# EAGLE design untitled (EAGLE 9.3.2)
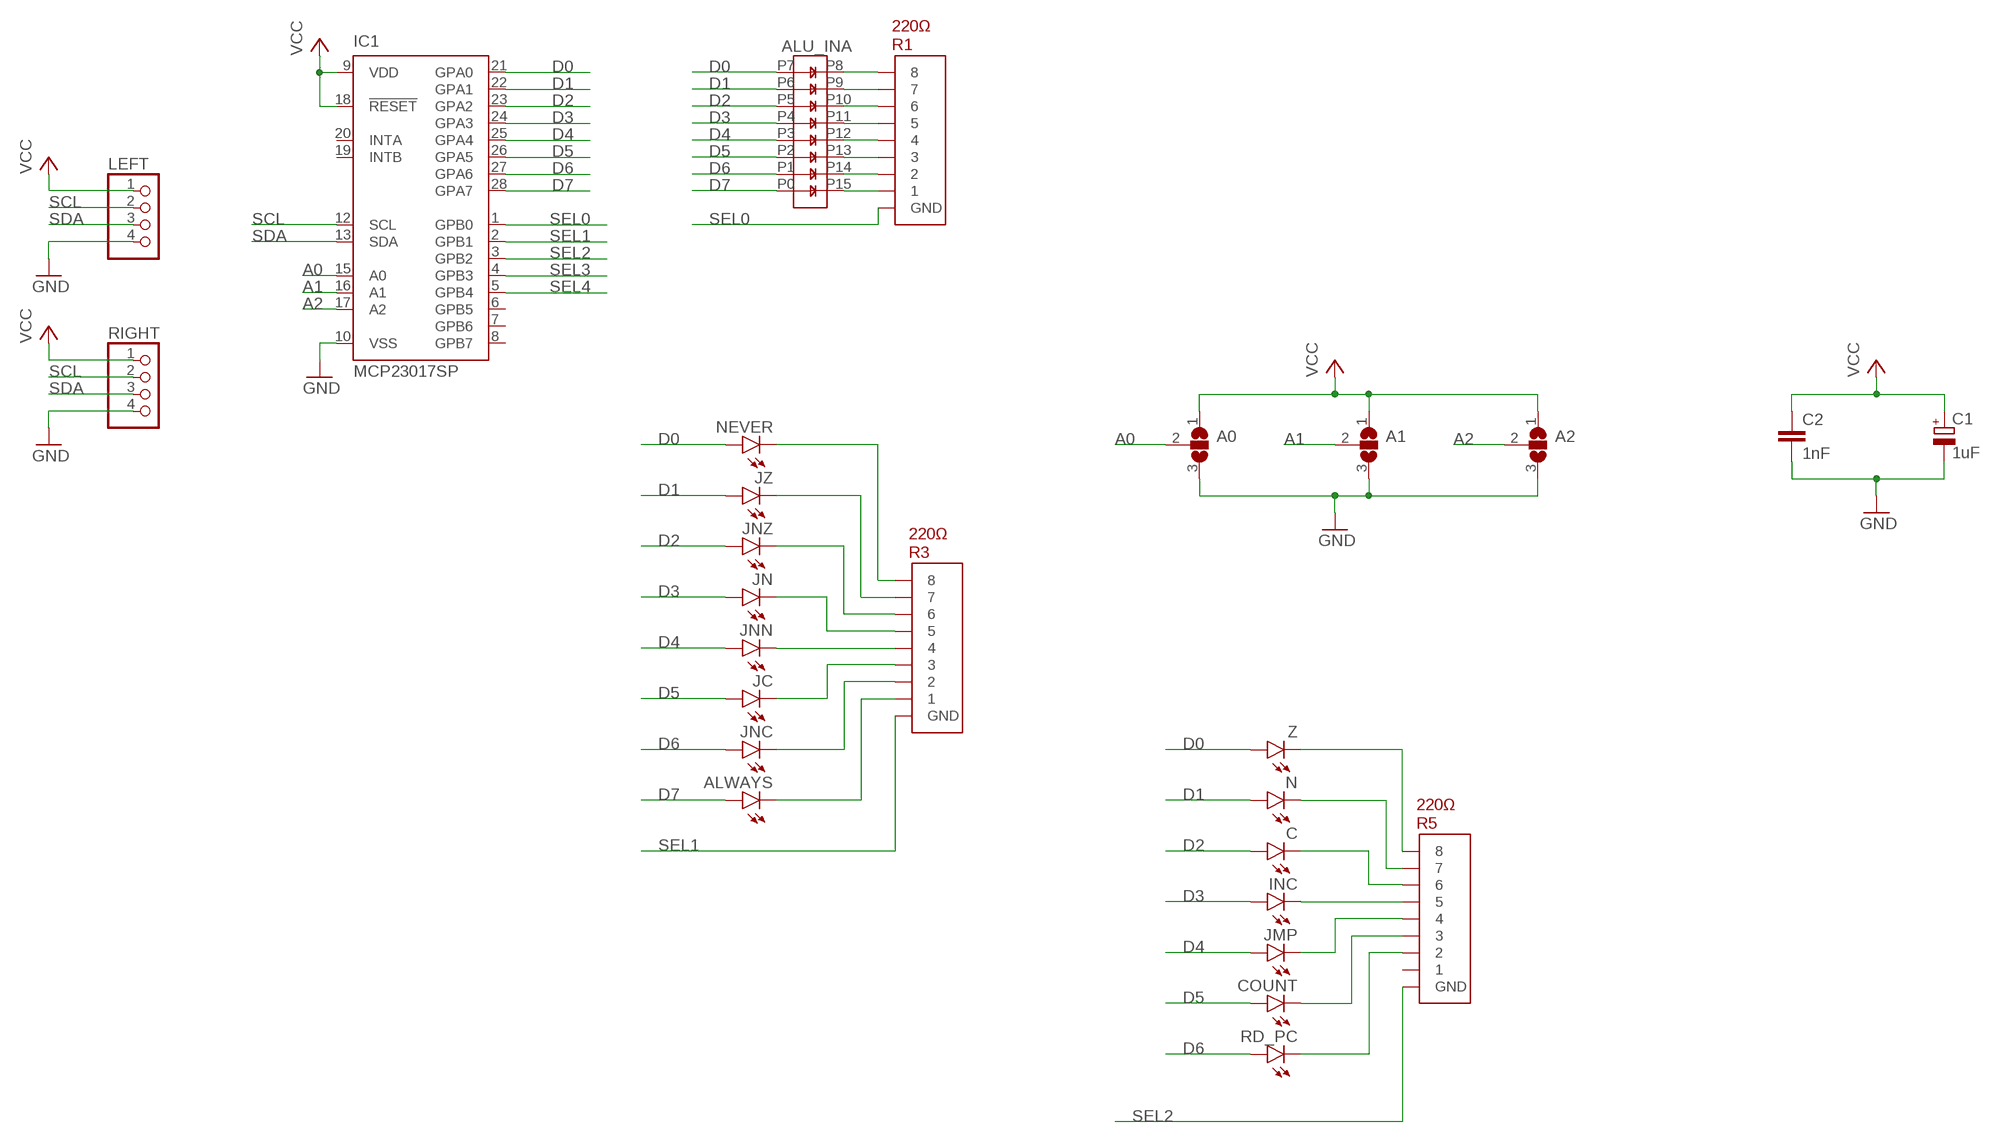
[diagram p0: schematic, sheet 1]

## Parts
A0  SJ2W  [SJ_2]
A1  SJ2W  [SJ_2]
A2  SJ2W  [SJ_2]
ALU_INA  LB8  [LB8]
ALWAYS  LED3MM  [LED3MM]
C  LED3MM  [LED3MM]
C1  1uF  CPOL-EUE2.5-6  [E2,5-6]
C2  1nF  C2.5/2  [C2.5-2]
COUNT  LED3MM  [LED3MM]
IC1  MCP23017SP  [DIL28-3]
INC  LED3MM  [LED3MM]
JC  LED3MM  [LED3MM]
JMP  LED3MM  [LED3MM]
JN  LED3MM  [LED3MM]
JNC  LED3MM  [LED3MM]
JNN  LED3MM  [LED3MM]
JNZ  LED3MM  [LED3MM]
JZ  LED3MM  [LED3MM]
LEFT  PINHD-1X4  [1X04]
N  LED3MM  [LED3MM]
NEVER  LED3MM  [LED3MM]
R1  220Ω  R_ARRAY_8PIN  [R_ARRAY_8PIN]
R3  220Ω  R_ARRAY_8PIN  [R_ARRAY_8PIN]
R5  220Ω  R_ARRAY_8PIN  [R_ARRAY_8PIN]
RD_PC  LED3MM  [LED3MM]
RIGHT  PINHD-1X4  [1X04]
Z  LED3MM  [LED3MM]

## Nets
A0: A0.2 IC1.15(A0)
A1: A1.2 IC1.16(A1)
A2: A2.2 IC1.17(A2)
D0: ALU_INA.P7 IC1.21(GPA0) NEVER.A Z.A
D1: ALU_INA.P6 IC1.22(GPA1) JZ.A N.A
D2: ALU_INA.P5 C.A IC1.23(GPA2) JNZ.A
D3: ALU_INA.P4 IC1.24(GPA3) INC.A JN.A
D4: ALU_INA.P3 IC1.25(GPA4) JMP.A JNN.A
D5: ALU_INA.P2 COUNT.A IC1.26(GPA5) JC.A
D6: ALU_INA.P1 IC1.27(GPA6) JNC.A RD_PC.A
D7: ALU_INA.P0 ALWAYS.A IC1.28(GPA7)
GND: A0.3 A1.3 A2.3 C1.- C2.2 IC1.10(VSS) LEFT.4 RIGHT.4
N$1: R5.8 Z.K(C)
N$2: N.K(C) R5.7
N$3: C.K(C) R5.6
N$4: INC.K(C) R5.5
N$5: JMP.K(C) R5.4
N$6: COUNT.K(C) R5.3
N$7: R5.2 RD_PC.K(C)
N$9: NEVER.K(C) R3.8
N$10: JZ.K(C) R3.7
N$11: JNZ.K(C) R3.6
N$12: JN.K(C) R3.5
N$13: JNN.K(C) R3.4
N$14: JC.K(C) R3.3
N$15: JNC.K(C) R3.2
N$16: ALWAYS.K(C) R3.1
N$17: ALU_INA.P8 R1.8
N$18: ALU_INA.P9 R1.7
N$19: ALU_INA.P10 R1.6
N$20: ALU_INA.P11 R1.5
N$21: ALU_INA.P12 R1.4
N$22: ALU_INA.P13 R1.3
N$23: ALU_INA.P14 R1.2
N$24: ALU_INA.P15 R1.1
SCL: IC1.12(SCL) LEFT.2 RIGHT.2
SDA: IC1.13(SDA) LEFT.3 RIGHT.3
SEL0: IC1.1(GPB0) R1.GND
SEL1: IC1.2(GPB1) R3.GND
SEL2: IC1.3(GPB2) R5.GND
SEL3: IC1.4(GPB3)
SEL4: IC1.5(GPB4)
VCC: A0.1 A1.1 A2.1 C1.+ C2.1 IC1.9(VDD) IC1.18(!RESET) LEFT.1 RIGHT.1
Unconnected: IC1.6(GPB5) IC1.7(GPB6) IC1.8(GPB7) IC1.19(INTB) IC1.20(INTA) R5.1

## Library data of the parts
A0 A1 A2 = jumper:SJ2W: SMD solder JUMPER
ALU_INA = 8bit_components:LB8
ALWAYS C COUNT INC JC JMP JN JNC JNN JNZ JZ N NEVER RD_PC Z = led:LED: LED OSRAM: - CHIPLED LG R971, LG N971, LY N971, LG Q971, LY Q971, LO R971, LY R971 LH N974, LH R974 LS Q976, LO Q976, LY Q976 LO Q996 - Hyper CHIPLED LW Q18S LB Q993, LB Q99A, LB R99A - SideLED LS A670, LO A670, LY A670, LG A670, LP A670 LB A673, LV A673, LT A673, LW A673 LH A674 LY A675 LS A676, LA A676, LO A676, LY A676, LW A676 LS A679, LY A679, LG A679 - Hyper Micro SIDELED® LS Y876, LA Y876, LO Y876, LY Y876 LT Y87S - SmartLED LW L88C, LW L88S LB L89C, LB L89S, LG L890 LS L89K, LO L89K, LY L89K LS L896, LA L896, LO L896, LY L896 - TOPLED LS T670, LO T670, LY T670, LG T670, LP T670 LSG T670, LSP T670, LSY T670, LOP T670, LYG T670 LG T671, LOG T671, LSG T671 LB T673, LV T673, LT T673, LW T673 LH T674 LS T676, LA T676, LO T676, LY T676, LB T676, LH T676, LSB T676, LW T676 LB T67C, LV T67C, LT T67C, LS T67K, LO T67K, LY T67K, LW E67C LS E67B, LA E67B, LO E67B, LY E67B, LB E67C, LV E67C, LT E67C LW T67C LS T679, LY T679, LG T679 LS T770, LO T770, LY T770, LG T770, LP T770 LB T773, LV T773, LT T773, LW T773 LH T774 LS E675, LA E675, LY E675, LS T675 LS T776, LA T776, LO T776, LY T776, LB T776 LHGB T686 LT T68C, LB T68C - Hyper Mini TOPLED® LB M676 - Mini TOPLED Santana® LG M470 LS M47K, LO M47K, LY M47K Source: http://www.osram.convergy.de LUXEON: - LUMILED® LXK2-PW12-R00, LXK2-PW12-S00, LXK2-PW14-U00, LXK2-PW14-V00 LXK2-PM12-R00, LXK2-PM12-S00, LXK2-PM14-U00 LXK2-PE12-Q00, LXK2-PE12-R00, LXK2-PE12-S00, LXK2-PE14-T00, LXK2-PE14-U00 LXK2-PB12-K00, LXK2-PB12-L00, LXK2-PB12-M00, LXK2-PB14-N00, LXK2-PB14-P00, LXK2-PB14-Q00 LXK2-PR12-L00, LXK2-PR12-M00, LXK2-PR14-Q00, LXK2-PR14-R00 LXK2-PD12-Q00, LXK2-PD12-R00, LXK2-PD12-S00 LXK2-PH12-R00, LXK2-PH12-S00 LXK2-PL12-P00, LXK2-PL12-Q00, LXK2-PL12-R00 Source: www.luxeon.com KINGBRIGHT: KA-3528ASYC Source: www.kingbright.com
C1 = rcl:CPOL-EU: POLARIZED CAPACITOR, European symbol; SPICEPREFIX: C
C2 = capacitor-wima:C: CAPACITOR naming: grid - package width
IC1 = microchip:MCP23017: http://ww1.microchip.com/downloads/en/DeviceDoc/21952a.pdf Source: http://ww1.microchip.com/downloads/en/DeviceDoc/21952a.pdf; MF: MICROCHIP; MPN: MCP23017-E/SP; OC_FARNELL: 1332088; OC_NEWARK: 31K2959
LEFT RIGHT = pinhead:PINHD-1X4: PIN HEADER
R1 R3 R5 = 8bit_components:R_ARRAY_8PIN

## Board
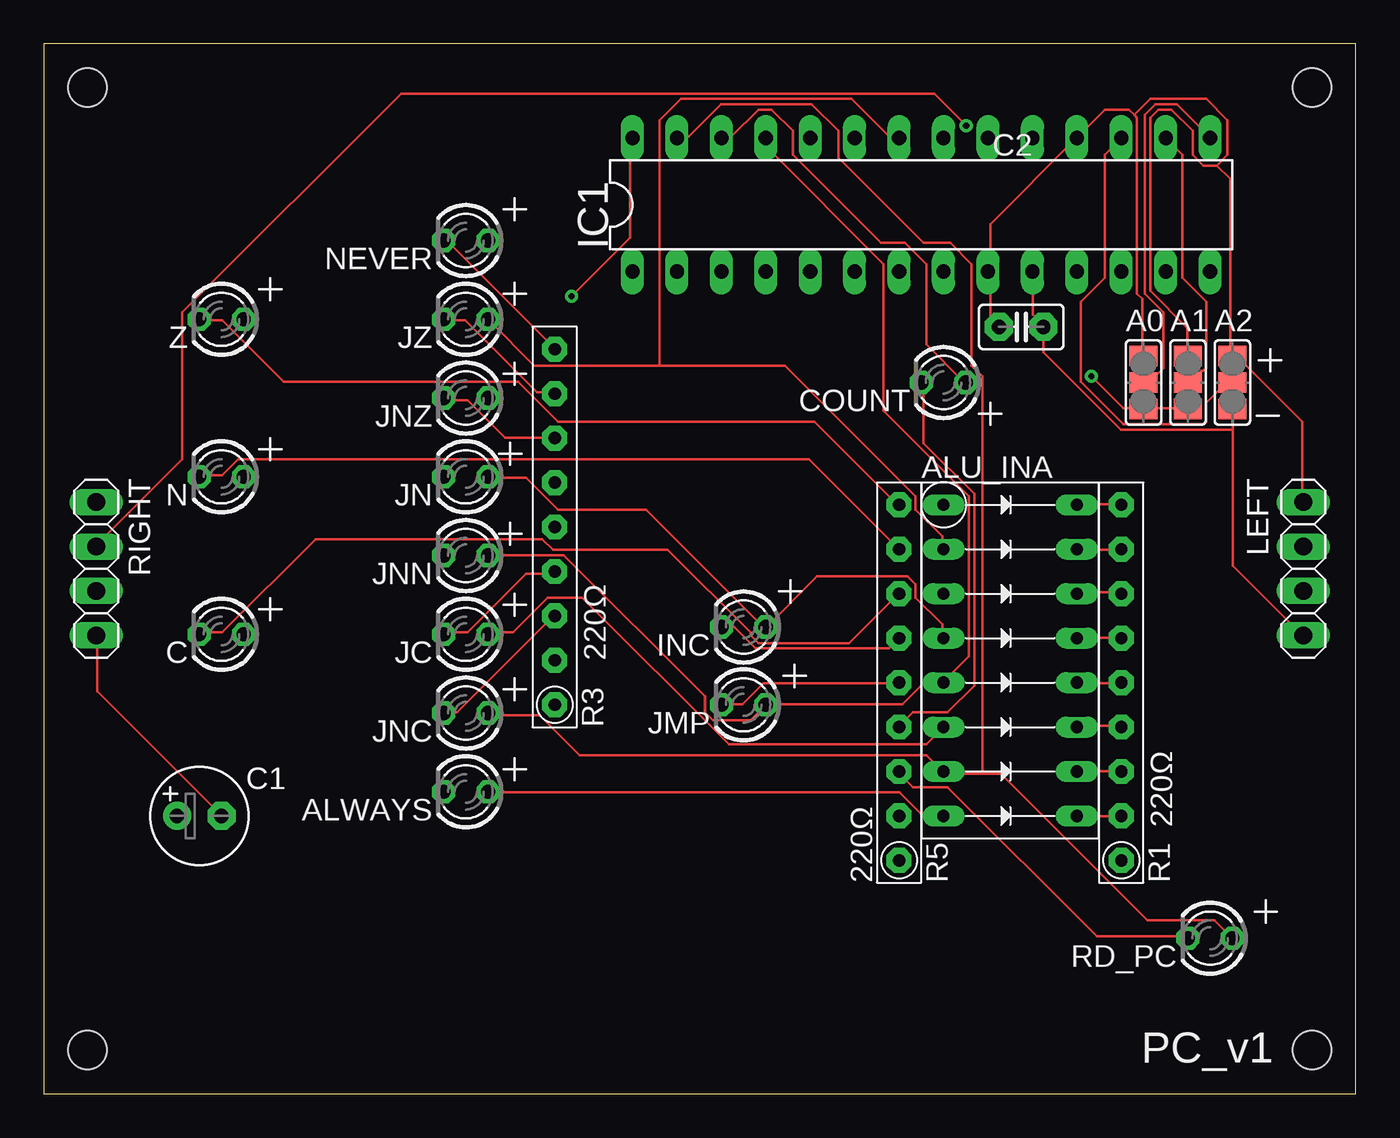
[diagram p1: board, top side]
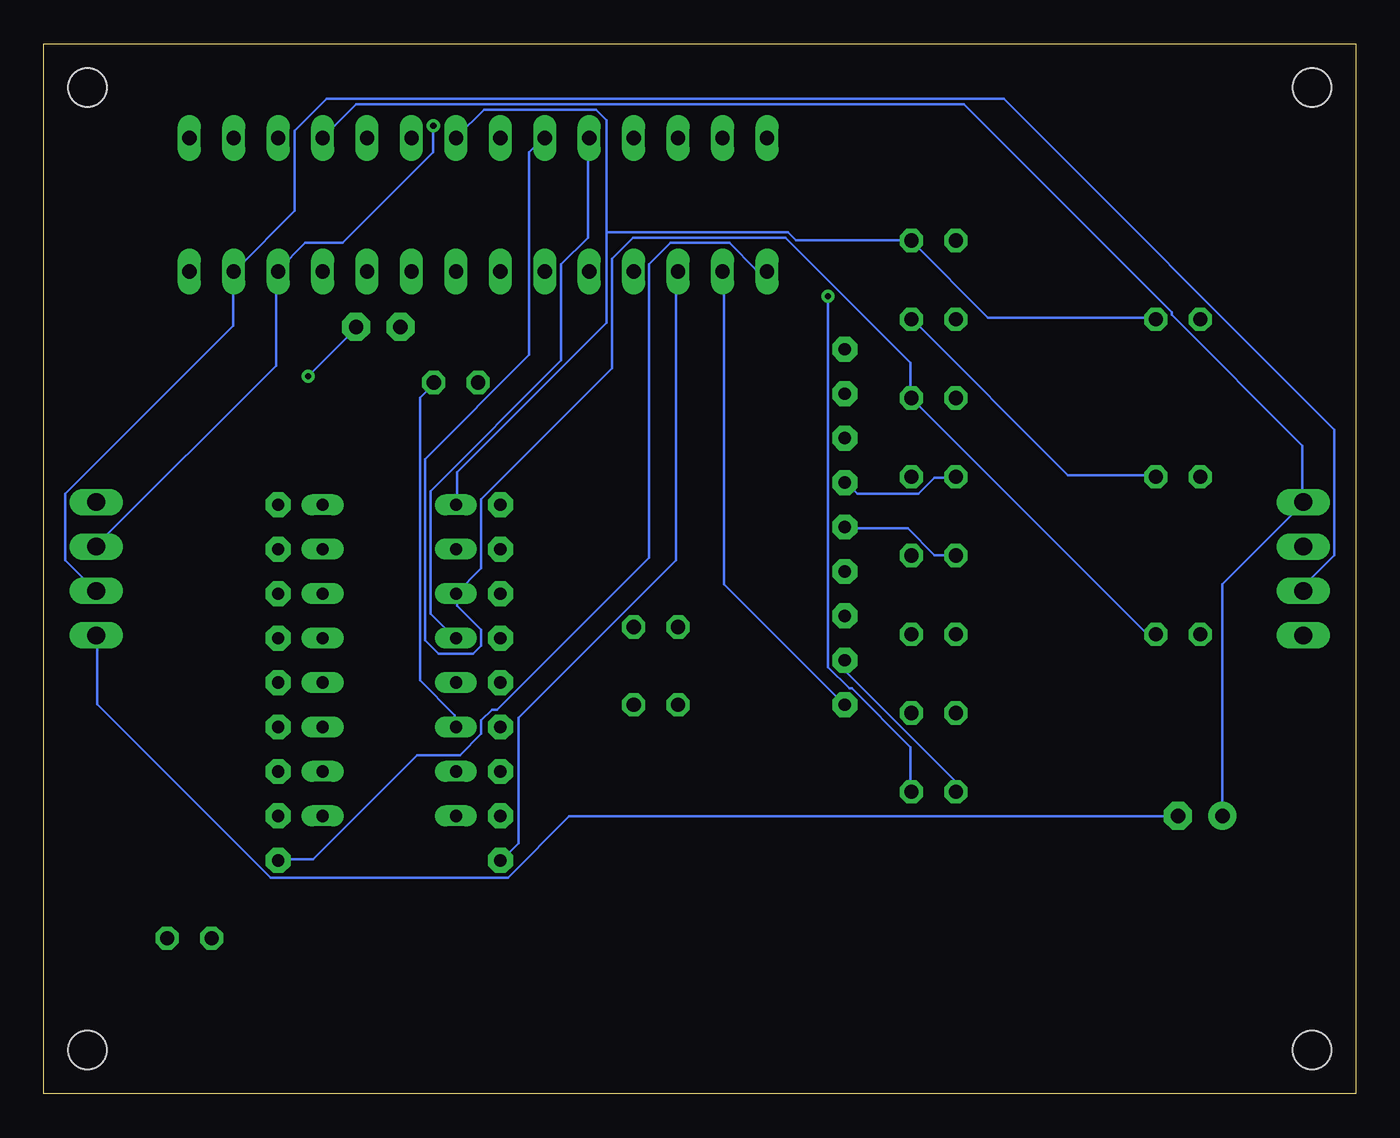
[diagram p2: board, bottom side, seen from below]

Size 75 x 60 mm. Coordinates in mm from the lower left corner, seen from the top.
Outline: 0,0 75,0 75,60 0,60 0,0
Copper layers (1*16): Top 0.035mm / dielectric 1.5mm / Bottom 0.035mm
Design rules "default": minimum track width 6mil, minimum drill 0.35mm, track to track 6mil, track to pad 6mil, pad to pad 6mil, via to via 6mil, smd to smd 6mil, copper to edge 40mil, drill to drill 6mil, minimum pad ring 10mil, minimum via ring 8mil, stop-mask expansion 4mil, vias tented up to drill 0mil, thermal gap 10mil
Holes 2.2 mm at 72.5,2.5 72.5,57.5 2.5,2.5 2.5,57.5
vRestrict: area 61,37.3 to 70.1,44.2

### Footprints (pad centres in the part's own frame; a part is rotated, then mirrored left to right if it is on the bottom)
SJ_2 = smd 1.168 x 1.6: 1 -1.524,0; 2 0,0; 3 1.524,0
LB8 = drill 0.7 long: P0 -3.81,-8.89; P1 -3.81,-6.35; P2 -3.81,-3.81; P3 -3.81,-1.27; P4 -3.81,1.27; P5 -3.81,3.81; P6 -3.81,6.35; P7 -3.81,8.89; P8 3.81,8.89; P9 3.81,6.35; P10 3.81,3.81; P11 3.81,1.27; P12 3.81,-1.27; P13 3.81,-3.81; P14 3.81,-6.35; P15 3.81,-8.89
LED3MM = drill 0.813 octagon: A -1.27,0; K 1.27,0
E2,5-6 = drill 0.813 pad 1.6: + -1.27,0 | drill 0.813 pad 1.6 octagon: - 1.27,0
C2.5-2 = drill 0.813 pad 1.6 octagon: 1 -1.27,0; 2 1.27,0
DIL28-3 = drill 0.813 long: 1 -16.51,-3.81; 2 -13.97,-3.81; 3 -11.43,-3.81; 4 -8.89,-3.81; 5 -6.35,-3.81; 6 -3.81,-3.81; 7 -1.27,-3.81; 8 1.27,-3.81; 9 3.81,-3.81; 10 6.35,-3.81; 11 8.89,-3.81; 12 11.43,-3.81; 13 13.97,-3.81; 14 16.51,-3.81; 15 16.51,3.81; 16 13.97,3.81; 17 11.43,3.81; 18 8.89,3.81; 19 6.35,3.81; 20 3.81,3.81; 21 1.27,3.81; 22 -1.27,3.81; 23 -3.81,3.81; 24 -6.35,3.81; 25 -8.89,3.81; 26 -11.43,3.81; 27 -13.97,3.81; 28 -16.51,3.81
1X04 = drill 1.016 long: 1 -3.81,0; 2 -1.27,0; 3 1.27,0; 4 3.81,0
R_ARRAY_8PIN = drill 0.7 pad 1.422 octagon: 1 0,-7.62; 2 0,-5.08; 3 0,-2.54; 4 0,0; 5 0,2.54; 6 0,5.08; 7 0,7.62; 8 0,10.16; GND 0,-10.16

### Placement (x,y rotation side)
A0  62.87,40.64 270 top
A1  65.41,40.64 270 top
A2  67.94,40.64 270 top
ALU_INA  55.24,24.77 0 top
ALWAYS  24.13,17.25 180 top
C  10.16,26.25 180 top
C1  8.89,15.88 0 top
C2  55.88,43.81 0 top
COUNT  51.44,40.64 180 top
IC1  50.16,50.8 0 top
INC  40.01,26.67 180 top
JC  24.13,26.25 180 top
JMP  40.01,22.23 180 top
JN  24.13,35.26 180 top
JNC  24.13,21.75 180 top
JNN  24.13,30.75 180 top
JNZ  24.13,39.76 180 top
JZ  24.13,44.26 180 top
LEFT  72,30 270 top
N  10.16,35.26 180 top
NEVER  24.13,48.76 180 top
R1  61.59,23.5 0 top
R3  29.21,32.38 0 top
R5  48.9,23.5 0 top
RD_PC  66.67,8.89 180 top
RIGHT  3,30 270 top
Z  10.16,44.26 180 top

### Tracks (layer width: path | path; a pad name or v marks a point on that pad's centre or on a via)
A0
  Top 0.152: A0.2 62.94,40.69 63.25,40.69 64.01,41.45 64.01,44.65 62.94,45.72 62.94,55.93 63.55,56.54 64.77,56.54 66.6,54.71 IC1.15
A1
  Top 0.152: A1.2 65.53,40.69 66.14,41.3 66.29,41.3 66.45,41.45 66.45,45.26 65.08,46.63 65.08,53.65 64.16,54.56 IC1.16
A2
  Top 0.152: A2.2 67.82,40.54 67.51,40.54 66.45,39.47 66.45,38.41 66.29,38.25 61.72,38.25 59.28,40.69 59.28,45.26 60.66,46.63 60.66,53.65 61.57,54.56 IC1.17
D0
  Bottom 0.152: Z.A 11.43,44.35 21.03,44.35 25.3,48.62 NEVER.A 25.45,48.77 32,48.77 32.46,49.23 42.82,49.23 | 42.82,49.23 42.82,55.63 43.43,56.24 49.84,56.24 51.36,54.71 IC1.21 | 42.82,49.23 42.82,44.04 51.36,35.51 51.36,33.68 ALU_INA.P7
D1
  Top 0.152: 35.2,41.6 28.04,41.6 25.45,44.2 JZ.A | 35.2,41.6 42.37,41.6 49.84,34.14 49.84,33.38 51.36,31.85 51.36,31.24 ALU_INA.P6 | 35.2,41.6 35.2,55.63 36.42,56.84 46.18,56.84 48.31,54.71 48.77,54.71 IC1.22
  Bottom 0.152: N.A 11.43,35.36 16.46,35.36 25.3,44.2 JZ.A
D2
  Bottom 0.152: C.A 11.43,26.36 12.04,26.36 25.3,39.62 JNZ.A 25.45,39.78 25.45,41.76 32.61,48.92 41.3,48.92 42.52,47.7 42.52,41.45 49.99,33.98 49.99,30.02 ALU_INA.P5 51.36,28.5 51.36,27.89 49.99,26.52 49.99,25.6 50.44,25.15 52.43,25.15 53.19,25.91 53.19,36.27 47.24,42.22 47.24,53.8 46.48,54.56 IC1.23
D3
  Top 0.152: ALU_INA.P4 51.36,26.06 51.36,26.82 49.84,28.35 49.84,29.11 49.38,29.57 44.2,29.57 41.3,26.67 INC.A 41.15,26.67 34.44,33.38 29.41,33.38 27.58,35.2 25.45,35.2 JN.A
  Bottom 0.152: IC1.24 43.89,54.56 43.89,48.92 45.41,47.4 45.41,41.91 52.88,34.44 52.88,27.43 51.51,26.06 ALU_INA.P4
D4
  Top 0.152: JNN.A 25.45,30.79 29.72,30.79 37.8,22.71 37.8,21.79 38.25,21.34 40.39,21.34 JMP.A 41.3,22.25 49.07,22.25 50.29,23.47 51.36,23.47 ALU_INA.P3 51.51,23.62 52.88,24.99 52.88,34.14 48.01,39.01 48.01,47.4 41.3,54.1 41.3,54.56 IC1.25
D5
  Top 0.152: ALU_INA.P2 50.44,19.96 39.17,19.96 30.79,28.35 28.8,28.35 26.82,26.36 25.45,26.36 JC.A | IC1.26 38.86,54.71 39.32,54.71 40.84,56.24 41.6,56.24 42.82,55.02 42.82,53.65 47.85,48.62 49.23,48.62 50.44,47.4 50.44,42.82 52.58,40.69 COUNT.A
  Bottom 0.152: ALU_INA.P2 51.51,21.03 51.51,21.64 53.49,23.62 53.49,39.78 52.73,40.54 COUNT.A
D6
  Top 0.152: 53.65,18.29 54.71,18.29 63.09,9.91 66.9,9.91 67.82,8.99 RD_PC.A | 53.65,18.29 51.51,18.29 ALU_INA.P1 51.36,18.44 50.44,19.36 30.63,19.36 28.35,21.64 25.45,21.64 JNC.A | 53.65,18.29 53.65,41 53.03,41.6 53.03,47.4 51.82,48.62 50.29,48.62 45.41,53.49 45.41,55.02 43.89,56.54 38.71,56.54 36.88,54.71 36.27,54.71 IC1.27
D7  (via drill 0.35)
  Top 0.152: ALU_INA.P0 51.36,16 50.14,16 48.92,17.22 25.45,17.22 ALWAYS.A | v30.18,45.57 33.53,48.92 33.53,54.56 IC1.28
  Bottom 0.152: v30.18,45.57 30.18,24.38 28.96,23.16 28.8,23.16 25.45,19.81 25.45,17.37 ALWAYS.A
GND  (via drill 0.35)
  Top 0.152: RIGHT.4 3.05,26.06 3.05,23.01 10.06,16 C1.- | A1.3 65.38,39.17 62.94,39.17 A0.3 62.79,39.17 61.72,39.17 v59.89,41 | IC1.10 56.54,46.94 56.54,44.5 57.15,43.89 C2.2 57.15,42.37 61.57,37.95 67.97,37.95 | 67.97,37.95 67.97,30.18 71.93,26.21 LEFT.4 | 67.97,37.95 67.97,39.01 A2.3
  Bottom 0.152: v59.89,41 57.15,43.74 C2.2 | C1.- 10.21,15.85 44.96,15.85 48.46,12.34 62.03,12.34 71.93,22.25 71.93,26.06 LEFT.4
N$1
  Top 0.152: Z.K 8.99,44.2 10.21,44.2 13.72,40.69 27.13,40.69 29.41,38.41 44.04,38.41 48.77,33.68 R5.8
N$2
  Top 0.152: R5.7 43.74,36.27 11.12,36.27 10.21,35.36 8.99,35.36 N.K
N$3
  Top 0.152: C.K 8.99,26.36 10.21,26.36 15.54,31.7 28.5,31.7 29.11,31.09 35.66,31.09 40.39,26.36 40.39,26.21 40.84,25.76 46.02,25.76 48.77,28.5 R5.6
N$4
  Top 0.152: INC.K 39.47,26.67 40.69,25.45 48.31,25.45 R5.5
N$5
  Top 0.152: JMP.K 38.86,22.25 39.93,22.25 41.15,23.47 48.77,23.47 R5.4
N$6
  Top 0.152: COUNT.K 50.29,40.54 50.29,37.19 53.19,34.29 53.19,23.32 51.66,21.79 49.68,21.79 48.92,21.03 R5.3
N$7
  Top 0.152: RD_PC.K 65.38,8.99 60.2,8.99 51.66,17.53 49.68,17.53 48.92,18.29 R5.2
N$9
  Top 0.152: NEVER.K 22.86,48.62 23.16,48.62 29.11,42.67 R3.8
N$10
  Top 0.152: JZ.K 22.86,44.2 24.08,44.2 28.19,40.08 29.11,40.08 R3.7
N$11
  Top 0.152: JNZ.K 22.86,39.62 24.23,39.62 26.36,37.49 29.11,37.49 R3.6
N$12
  Bottom 0.152: JN.K 22.86,35.2 24.08,35.2 24.99,34.29 28.5,34.29 29.11,34.9 R3.5
N$13
  Bottom 0.152: JNN.K 22.86,30.79 24.08,30.79 25.6,32.31 29.11,32.31 R3.4
N$14
  Top 0.152: JC.K 22.86,26.36 24.23,26.36 27.58,29.72 29.11,29.72 R3.3
N$15
  Top 0.152: JNC.K 22.86,21.79 23.62,21.79 29.11,27.28 R3.2
N$16
  Bottom 0.152: ALWAYS.K 22.86,17.83 29.11,24.08 29.11,24.69 R3.1
N$17
  Top 0.152: ALU_INA.P8 59.13,33.68 61.57,33.68 R1.8
N$18
  Top 0.152: ALU_INA.P9 59.13,31.09 61.57,31.09 R1.7
N$19
  Top 0.152: ALU_INA.P10 59.13,28.65 61.57,28.65 R1.6
N$20
  Top 0.152: ALU_INA.P11 59.13,26.06 61.57,26.06 R1.5
N$21
  Top 0.152: ALU_INA.P12 59.13,23.47 61.57,23.47 R1.4
N$22
  Top 0.152: ALU_INA.P13 59.13,21.03 61.57,21.03 R1.3
N$23
  Top 0.152: ALU_INA.P14 59.13,18.44 61.57,18.44 R1.2
N$24
  Top 0.152: ALU_INA.P15 59.13,15.85 61.57,15.85 R1.1
SCL  (via drill 0.35)
  Top 0.152: v52.73,55.32 50.9,57.15 20.42,57.15 7.92,44.65 7.92,36.27 3.05,31.39 RIGHT.2
  Bottom 0.152: LEFT.2 71.93,31.39 61.72,41.6 61.72,46.94 IC1.12 61.57,47.09 60.05,48.62 57.91,48.62 52.73,53.8 v52.73,55.32
SDA
  Bottom 0.152: LEFT.3 72.08,28.8 73.76,30.48 73.76,34.29 64.16,43.89 64.16,46.94 IC1.13 64.01,47.09 60.66,50.44 60.66,55.02 58.83,56.84 20.12,56.84 1.22,37.95 1.22,30.79 2.9,29.11 2.9,28.8 RIGHT.3
SEL0
  Bottom 0.152: IC1.1 33.68,47.09 34.29,47.09 35.81,48.62 39.17,48.62 40.39,47.4 40.39,30.63 49.07,21.95 49.38,21.95 49.99,21.34 49.99,20.57 51.21,19.36 53.65,19.36 59.59,13.41 61.57,13.41 R1.GND
SEL1
  Bottom 0.152: IC1.2 36.12,46.94 36.12,29.11 29.26,22.25 R3.GND
SEL2
  Bottom 0.152: IC1.3 38.86,46.94 38.86,30.48 47.85,21.49 47.85,14.33 48.77,13.41 R5.GND
VCC
  Top 0.152: LEFT.1 71.93,33.83 71.93,38.41 68.28,42.06 67.97,42.06 A2.1 67.82,42.22 67.82,52.27 67.06,53.03 | C2.1 54.56,43.89 54.1,44.35 54.1,46.94 IC1.9 54.1,47.09 54.1,49.68 58.98,54.56 IC1.18 59.13,54.71 60.66,56.24 62.03,56.24 62.33,55.93 | 62.33,55.93 62.48,55.78 62.48,45.72 62.79,45.41 62.79,42.22 A0.1 | 67.06,53.03 66.29,53.03 65.68,53.65 65.68,55.02 64.47,56.24 63.7,56.24 63.25,55.78 63.25,45.87 65.38,43.74 65.38,42.22 A1.1 | 67.06,53.03 67.67,53.65 67.67,55.63 66.45,56.84 63.25,56.84 62.33,55.93
  Bottom 0.152: C1.+ 7.62,29.11 3.05,33.68 RIGHT.1 3.05,33.83 3.05,37.03 10.52,44.5 10.52,44.65 22.4,56.54 57.15,56.54 58.98,54.71 IC1.18

### Text on the board
tPlace: PC_v1